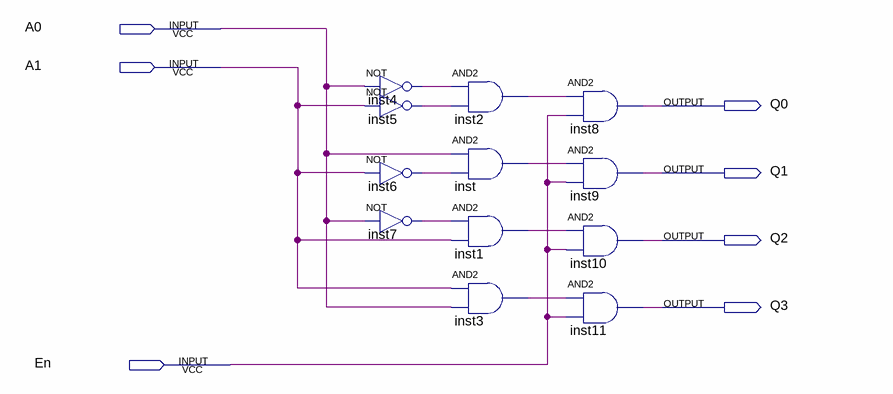
[diagram p0: schematic sheet]
// Quartus schematic DC_2input.bdf as structural Verilog: 12 symbols, 7 pins
module DC_2input (
  input  A0,
  input  A1,
  input  En,
  output Q0,
  output Q1,
  output Q2,
  output Q3
);

  wire inst1_out, inst2_out, inst3_out, inst4_out, inst5_out, inst6_out, inst7_out, inst_out;

  not inst4 (inst4_out, A0);
  not inst5 (inst5_out, A1);
  not inst6 (inst6_out, A1);
  not inst7 (inst7_out, A0);
  and inst2 (inst2_out, inst4_out, inst5_out);
  and inst (inst_out, A0, inst6_out);
  and inst1 (inst1_out, inst7_out, A1);
  and inst3 (inst3_out, A1, A0);
  and inst8 (Q0, inst2_out, En);
  and inst9 (Q1, inst_out, En);
  and inst10 (Q2, inst1_out, En);
  and inst11 (Q3, inst3_out, En);
endmodule
